# EAGLE design passive attenumixer (EAGLE 9.6.2)
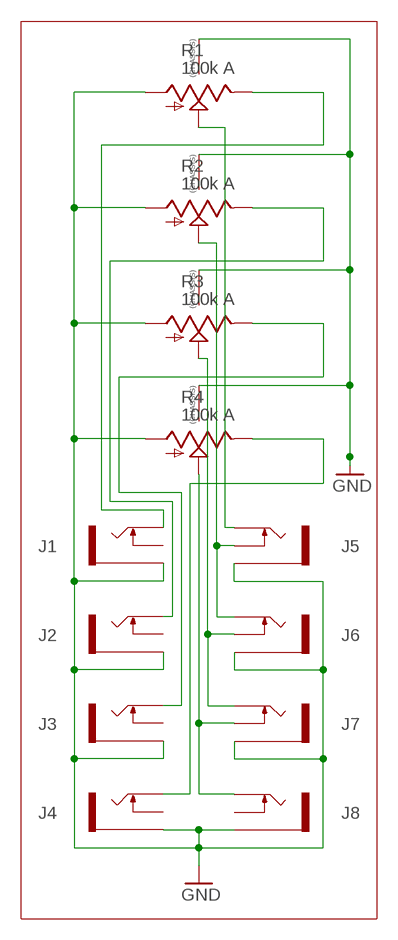
[diagram p0: schematic, sheet 1]

## Parts
J1  THONKICONNNEW  [WQP-PJ301M-12_JACK]
J2  THONKICONNNEW  [WQP-PJ301M-12_JACK]
J3  THONKICONNNEW  [WQP-PJ301M-12_JACK]
J4  THONKICONNNEW  [WQP-PJ301M-12_JACK]
J5  THONKICONNNEW  [WQP-PJ301M-12_JACK]
J6  THONKICONNNEW  [WQP-PJ301M-12_JACK]
J7  THONKICONNNEW  [WQP-PJ301M-12_JACK]
J8  THONKICONNNEW  [WQP-PJ301M-12_JACK]
R1  100k A  9MM_SNAP-IN_POT_CHASSIS  [9MM_SNAP-IN_POT]
R2  100k A  9MM_SNAP-IN_POT_CHASSIS  [9MM_SNAP-IN_POT]
R3  100k A  9MM_SNAP-IN_POT_CHASSIS  [9MM_SNAP-IN_POT]
R4  100k A  9MM_SNAP-IN_POT_CHASSIS  [9MM_SNAP-IN_POT]

## Nets
GND: J1.P$3_SLEEVE(SLEEVE) J2.P$3_SLEEVE(SLEEVE) J3.P$3_SLEEVE(SLEEVE) J4.P$3_SLEEVE(SLEEVE) J5.P$3_SLEEVE(SLEEVE) J6.P$3_SLEEVE(SLEEVE) J7.P$3_SLEEVE(SLEEVE) J8.P$3_SLEEVE(SLEEVE) R1.1(A) R1.CHASSIS1 R1.CHASSIS2 R2.1(A) R2.CHASSIS1 R2.CHASSIS2 R3.1(A) R3.CHASSIS1 R3.CHASSIS2 R4.1(A) R4.CHASSIS1 R4.CHASSIS2
N$2: J5.P$1_TIP(TIP) R1.2(S)
N$5: J7.P$2_SWITCH(SWITCH) J8.P$1_TIP(TIP) R4.2(S)
N$6: J6.P$2_SWITCH(SWITCH) J7.P$1_TIP(TIP) R3.2(S)
N$7: J5.P$2_SWITCH(SWITCH) J6.P$1_TIP(TIP) R2.2(S)
N$9: J1.P$1_TIP(TIP) R1.3(E)
N$10: J2.P$1_TIP(TIP) R2.3(E)
N$11: J3.P$1_TIP(TIP) R3.3(E)
N$12: J4.P$1_TIP(TIP) R4.3(E)
Unconnected: J1.P$2_SWITCH(SWITCH) J2.P$2_SWITCH(SWITCH) J3.P$2_SWITCH(SWITCH) J4.P$2_SWITCH(SWITCH) J8.P$2_SWITCH(SWITCH)

## Library data of the parts
J1-J8 = MusicThingModular:THONKICONN: 3.5mm socket for Eurorack modular synths
R1-R4 = MusicThingModular:9MM_SNAP-IN_POT_CHASSIS: 9mm vertical snap-in pot, Alpha / Panasonic style, with a connection to the metal chassis for grounding

## Board
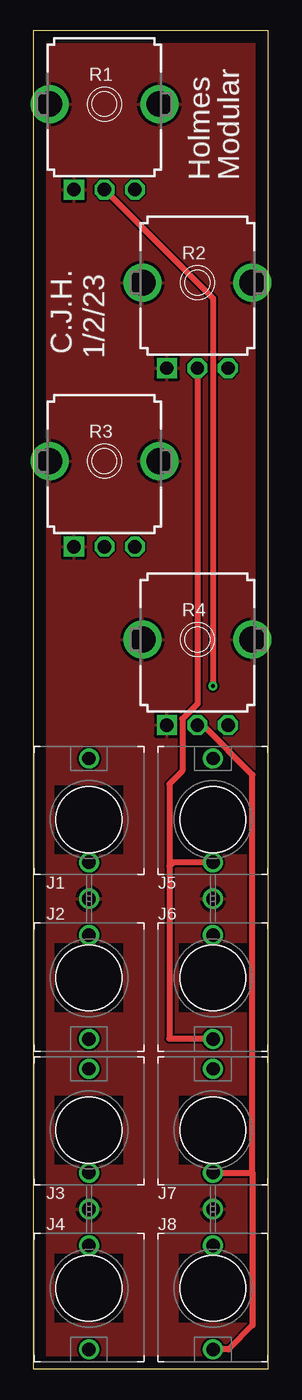
[diagram p1: board, top side]
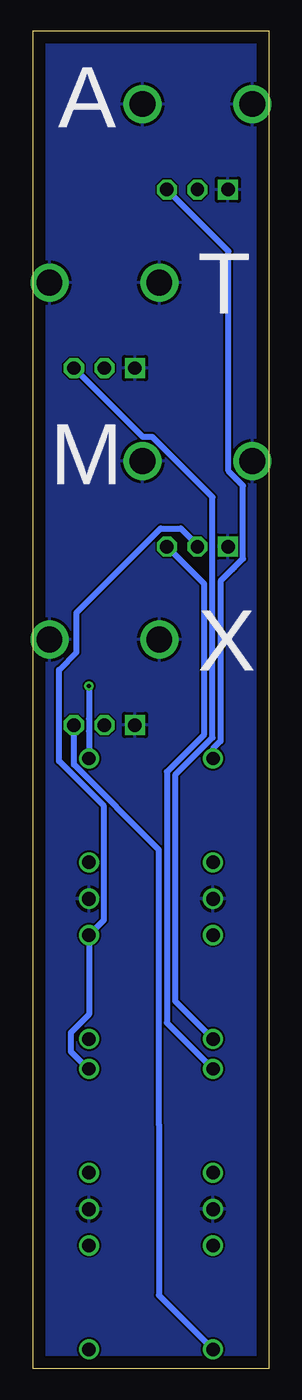
[diagram p2: board, bottom side, seen from below]

Size 19.28 x 109.53 mm. Coordinates in mm from the lower left corner, seen from the top.
Outline: 0,0 19.28,0 19.28,109.53 0,109.53 0,0
Copper layers (1*16): Top 0.035mm / dielectric 1.5mm / Bottom 0.035mm
Design rules "default": minimum track width 6mil, minimum drill 0.35mm, track to track 6mil, track to pad 6mil, pad to pad 6mil, via to via 6mil, smd to smd 6mil, copper to edge 40mil, drill to drill 6mil, minimum pad ring 10mil, minimum via ring 8mil, stop-mask expansion 4mil, vias tented up to drill 0mil, thermal gap 10mil

### Footprints (pad centres in the part's own frame; a part is rotated, then mirrored left to right if it is on the bottom)
WQP-PJ301M-12_JACK = drill 1.1: P$1_TIP 0,5; P$2_SWITCH 0,-3.5; P$3_SLEEVE 0,-6.5
9MM_SNAP-IN_POT = drill 1.1 square: 1 -2.5,-7 | drill 1.1 octagon: 2 0,-7; 3 2.5,-7 | drill 2.1 pad 2.794: CHASSIS1 -4.5,0; CHASSIS2 4.5,0

### Placement (x,y rotation side)
J1  4.57,44.96 0 top
J2  4.57,32 180 top
J3  4.57,19.56 0 top
J4  4.57,6.6 180 top
J5  14.73,44.96 0 top
J6  14.73,32 180 top
J7  14.73,19.56 0 top
J8  14.73,6.6 180 top
R1  5.84,103.5 0 top
R2  13.46,88.9 0 top
R3  5.84,74.3 0 top
R4  13.46,59.69 0 top

### Tracks (layer width: path | path; a pad name or v marks a point on that pad's centre or on a via)
GND
  pour Bottom: 0,0 19.3,0 19.3,109.54 0,109.54
  pour Top: 0,0 19.3,0 19.3,109.54 0,109.54
N$2  (via drill 0.35)
  Top 0.508: v14.73,55.88 14.73,81.39 14.73,87.62 R1.2
  Bottom 0.508: v14.73,55.88 14.73,53.2 14.73,52.18 J5.P$1_TIP
N$5
  Top 0.508: 17.97,16.06 17.97,48.62 13.9,52.69 R4.2 | J7.P$2_SWITCH 17.97,16.06 | 17.97,16.06 17.97,3.56 16.02,1.6 J8.P$1_TIP
N$6
  Bottom 0.508: J7.P$1_TIP 14.79,24.56 16.22,25.99 16.22,27.51 14.73,29 J6.P$2_SWITCH 13.5,36.74 13.5,46.05 17.19,49.74 17.19,57.21 15.75,58.66 15.75,61.88 8.85,68.78 7.2,68.78 5.84,67.42 R3.2
N$7
  Top 0.508: R2.2 13.46,54.43 12.23,53.2 12.23,48.92 11.17,47.86 11.17,41.15 | J6.P$1_TIP 14.69,27.05 11.17,27.05 11.17,41.15 | J5.P$2_SWITCH 11.48,41.46 11.17,41.15
N$9
  Bottom 0.508: R1.3 3.31,91.47 3.31,73.48 2.11,72.29 2.11,66.3 2.84,65.58 2.97,65.44 3.95,64.46 3.95,51.39 4.57,50.77 J1.P$1_TIP
N$10
  Bottom 0.508: R2.3 10.32,76.26 9.53,76.26 4.61,71.34 4.61,51.66 7.68,48.59 7.68,30.11 J2.P$1_TIP
N$11
  Bottom 0.508: R3.3 5.28,64.24 5.28,51.92 8.34,48.87 8.34,28.32 J3.P$1_TIP
N$12
  Bottom 0.508: R4.3 15.96,50.47 15.96,49.45 9,42.48 9,20.32 9,20.01 9,6.03 J4.P$1_TIP

### Text on the board
tNames: Holmes | Modular | C.J.H. | 1/2/23
bNames: A | T | M | X